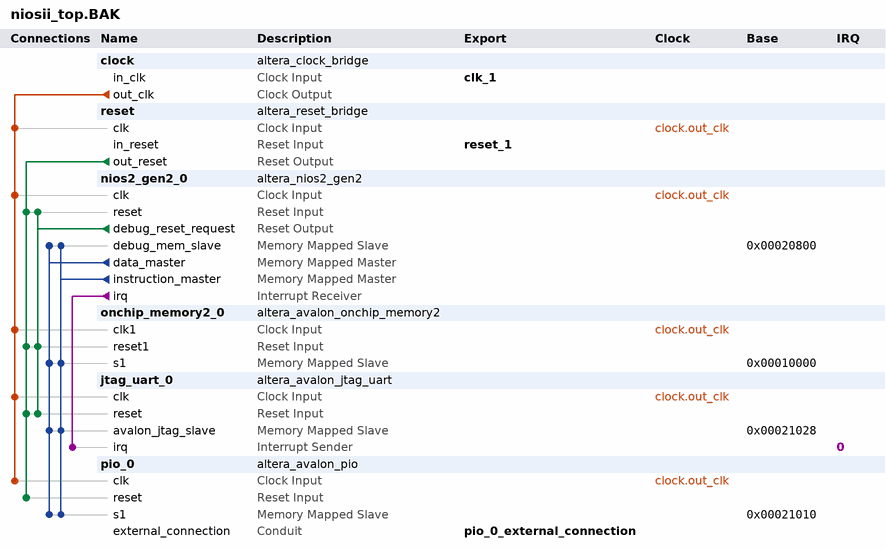
[diagram p0: system contents]
# Platform Designer (Qsys) system niosii_top.BAK, Cyclone V 5CEBA4F23C7
# Parameters at their usual value, and those the tool derives, are not listed.
package require -exact qsys 22.1
create_system niosii_top.BAK
set_project_property DEVICE_FAMILY {Cyclone V}
set_project_property DEVICE 5CEBA4F23C7

add_instance clock altera_clock_bridge 22.1
set_instance_parameter_value clock DERIVED_CLOCK_RATE 0
set_instance_parameter_value clock EXPLICIT_CLOCK_RATE 100000000

add_instance reset altera_reset_bridge 22.1
set_instance_parameter_value reset ACTIVE_LOW_RESET 1
set_instance_parameter_value reset SYNCHRONOUS_EDGES deassert

add_instance nios2_gen2_0 altera_nios2_gen2 22.1
set_instance_parameter_value nios2_gen2_0 dcache_size 2048
set_instance_parameter_value nios2_gen2_0 exceptionSlave onchip_memory2_0.s1
set_instance_parameter_value nios2_gen2_0 icache_size 4096
set_instance_parameter_value nios2_gen2_0 impl Tiny
set_instance_parameter_value nios2_gen2_0 resetSlave onchip_memory2_0.s1

add_instance onchip_memory2_0 altera_avalon_onchip_memory2 22.1
set_instance_parameter_value onchip_memory2_0 dataWidth 32
set_instance_parameter_value onchip_memory2_0 dualPort false
set_instance_parameter_value onchip_memory2_0 initMemContent true
set_instance_parameter_value onchip_memory2_0 initializationFileName onchip_mem.hex
set_instance_parameter_value onchip_memory2_0 memorySize 49152

add_instance jtag_uart_0 altera_avalon_jtag_uart 22.1
set_instance_parameter_value jtag_uart_0 simInteractiveOptions NO_INTERACTIVE_WINDOWS

add_instance pio_0 altera_avalon_pio 22.1
set_instance_parameter_value pio_0 direction Output
set_instance_parameter_value pio_0 width 10

# connections
add_connection clock.out_clk jtag_uart_0.clk clock
add_connection clock.out_clk nios2_gen2_0.clk clock
add_connection clock.out_clk onchip_memory2_0.clk1 clock
add_connection clock.out_clk pio_0.clk clock
add_connection clock.out_clk reset.clk clock
add_connection nios2_gen2_0.debug_reset_request jtag_uart_0.reset reset
add_connection nios2_gen2_0.debug_reset_request nios2_gen2_0.reset reset
add_connection nios2_gen2_0.debug_reset_request onchip_memory2_0.reset1 reset
add_connection reset.out_reset jtag_uart_0.reset reset
add_connection reset.out_reset nios2_gen2_0.reset reset
add_connection reset.out_reset onchip_memory2_0.reset1 reset
add_connection reset.out_reset pio_0.reset reset
add_connection nios2_gen2_0.data_master jtag_uart_0.avalon_jtag_slave avalon
set_connection_parameter_value nios2_gen2_0.data_master/jtag_uart_0.avalon_jtag_slave baseAddress 0x00021028
add_connection nios2_gen2_0.data_master nios2_gen2_0.debug_mem_slave avalon
set_connection_parameter_value nios2_gen2_0.data_master/nios2_gen2_0.debug_mem_slave baseAddress 0x00020800
add_connection nios2_gen2_0.data_master onchip_memory2_0.s1 avalon
set_connection_parameter_value nios2_gen2_0.data_master/onchip_memory2_0.s1 baseAddress 0x00010000
add_connection nios2_gen2_0.data_master pio_0.s1 avalon
set_connection_parameter_value nios2_gen2_0.data_master/pio_0.s1 baseAddress 0x00021010
add_connection nios2_gen2_0.instruction_master jtag_uart_0.avalon_jtag_slave avalon
set_connection_parameter_value nios2_gen2_0.instruction_master/jtag_uart_0.avalon_jtag_slave baseAddress 0x00021028
add_connection nios2_gen2_0.instruction_master nios2_gen2_0.debug_mem_slave avalon
set_connection_parameter_value nios2_gen2_0.instruction_master/nios2_gen2_0.debug_mem_slave baseAddress 0x00020800
add_connection nios2_gen2_0.instruction_master onchip_memory2_0.s1 avalon
set_connection_parameter_value nios2_gen2_0.instruction_master/onchip_memory2_0.s1 baseAddress 0x00010000
add_connection nios2_gen2_0.instruction_master pio_0.s1 avalon
set_connection_parameter_value nios2_gen2_0.instruction_master/pio_0.s1 baseAddress 0x00021010
add_connection nios2_gen2_0.irq jtag_uart_0.irq interrupt
set_connection_parameter_value nios2_gen2_0.irq/jtag_uart_0.irq irqNumber 0

# exported interfaces
add_interface clk_1 clock sink
set_interface_property clk_1 EXPORT_OF clock.in_clk
add_interface pio_0_external_connection conduit end
set_interface_property pio_0_external_connection EXPORT_OF pio_0.external_connection
add_interface reset_1 reset sink
set_interface_property reset_1 EXPORT_OF reset.in_reset

set_interconnect_requirement {$system} qsys_mm.clockCrossingAdapter HANDSHAKE
set_interconnect_requirement {$system} qsys_mm.enableEccProtection FALSE
set_interconnect_requirement {$system} qsys_mm.insertDefaultSlave FALSE
set_interconnect_requirement {$system} qsys_mm.maxAdditionalLatency 1

save_system niosii_top.BAK.qsys
